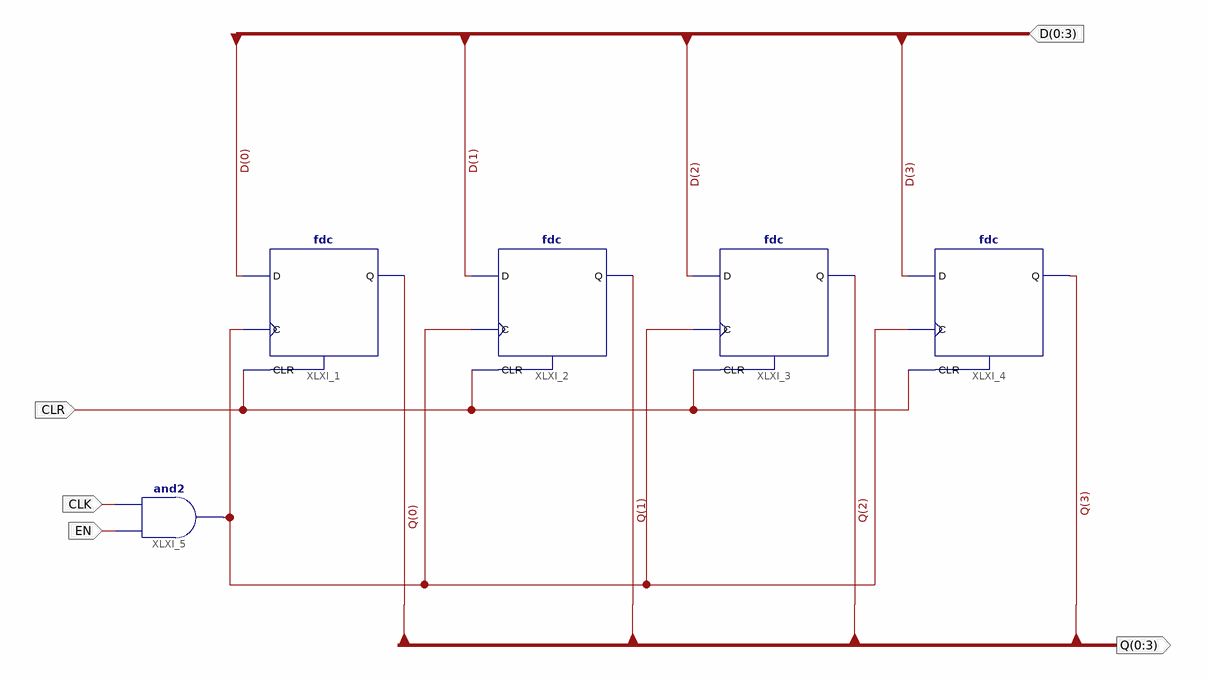
[diagram p0: schematic sheet 1]
// Xilinx ISE schematic Register4bit.sch (spartan3e) as structural Verilog: 5 symbols, 5 ports
module Register4bit (
  input  CLR,
  input  EN,
  input  CLK,
  input  [0:3] D,
  output [0:3] Q
);

  wire XLXN_23;

  fdc XLXI_1 (.C(XLXN_23), .CLR(CLR), .D(D[0]), .Q(Q[0]));
  fdc XLXI_2 (.C(XLXN_23), .CLR(CLR), .D(D[1]), .Q(Q[1]));
  fdc XLXI_3 (.C(XLXN_23), .CLR(CLR), .D(D[2]), .Q(Q[2]));
  fdc XLXI_4 (.C(XLXN_23), .CLR(CLR), .D(D[3]), .Q(Q[3]));
  and XLXI_5 (XLXN_23, EN, CLK);
endmodule
